# Altium schematic sheet Sheet1.SchDoc
size A3; SheetNumber: 1; SheetTotal: 1
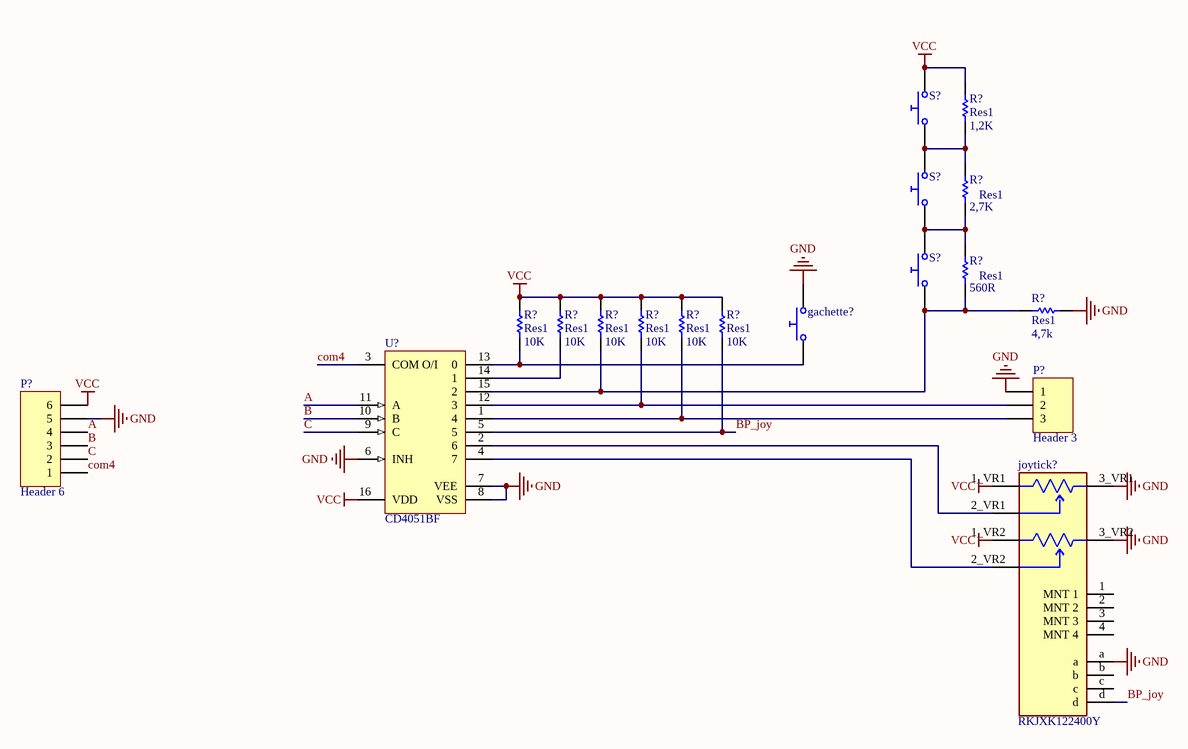
[diagram p0: Sheet1.SchDoc]

## Parts
(Parts that share a designator on the sheet are numbered #1, #2 ... from top to bottom, then left to right.)
gachette?  Push Button Normally Opened  (value not drawn)
joytick?  RKJXK122400Y  [FP-RKJXK122400Y-MFG]
P?#1  Header 3  [HDR1X3]
P?#2  Header 6  [HDR1X6]
R?#1  Res1  value 1,2K  [AXIAL-0.3]
R?#2  Res1  value 2,7K  [AXIAL-0.3]
R?#3  Res1  value 560R  [AXIAL-0.3]
R?#4  Res1  value 4,7k  [AXIAL-0.3]
R?#5  Res1  value 10K  [AXIAL-0.3]
R?#6  Res1  value 10K  [AXIAL-0.3]
R?#7  Res1  value 10K  [AXIAL-0.3]
R?#8  Res1  value 10K  [AXIAL-0.3]
R?#9  Res1  value 10K  [AXIAL-0.3]
R?#10  Res1  value 10K  [AXIAL-0.3]
S?#1  Push Button Normally Opened  (value not drawn)
S?#2  Push Button Normally Opened  (value not drawn)
S?#3  Push Button Normally Opened  (value not drawn)
U?  CD4051BF  [J0016A]

## Nets
GND: gachette?.2 joytick?.3_VR1(3_VR1) joytick?.3_VR2(3_VR2) joytick?.a P?#1.1 P?#2.5 R?#4.1 U?.6(INH) U?.7(VEE) U?.8(VSS)
VCC: joytick?.1_VR1(1_VR1) joytick?.1_VR2(1_VR2) P?#2.6 R?#1.2 R?#5.2 R?#6.2 R?#7.2 R?#8.2 R?#9.2 R?#10.2 S?#1.2 U?.16(VDD)
A: P?#2.4 U?.11(A)
B: P?#2.3 U?.10(B)
BP_joy: joytick?.d R?#10.1 U?.5
C: P?#2.2 U?.9(C)
com4: P?#2.1 U?.3(COM_O/I)
Netgachette?_1: gachette?.1 R?#5.1 U?.13(0)
Netjoytick?_2_VR1: joytick?.2_VR1(2_VR1) U?.2(6)
Netjoytick?_2_VR2: joytick?.2_VR2(2_VR2) U?.4(7)
NetP?#1_2: P?#1.2 R?#8.1 U?.12(3)
NetP?#1_3: P?#1.3 R?#9.1 U?.1(4)
NetR?#1_1: R?#1.1 R?#2.2 S?#1.1 S?#2.2
NetR?#2_1: R?#2.1 R?#3.2 S?#2.1 S?#3.2
NetR?#3_1: R?#3.1 R?#4.2 R?#7.1 S?#3.1 U?.15(2)
NetR?#6_1: R?#6.1 U?.14(1)

Not connected (* = marked no-connect by the designer): joytick? 1(MNT_1) 2(MNT_2) 3(MNT_3) 4(MNT_4) b c

## Library data of the parts
gachette? S?#1-S?#3 = Push Button NO: closed: 0; Rclosed: 1m; Ropen: 1Meg; SimulationGenericComponent: True
joytick? = CMP-24118-000005-1: Res POT 10K Ohm 0.0125W (25.4 X 20.7 X 19.3mm) Pin Bracket Mount/Through Hole Tray; Insulation Resistance: 100MR; Resistance: 10kR; Power Rating: 12.5mW; Current Rating: 50mA; Life (Hours): 100Hour; Type: Potentiometer; Mount: Through Hole; Series: RKJXV/ RKJXK; Packaging: Tray; Radiation Hardening: No; Resistor Type: Potentiometer; Termination: Pin; Height: 12.9mm; Military Standard: Not; Min Operating Temperature: -10°C; Max Operating Temperature: 70°C; Package Quantity: 1000; Contact Current Rating: 50mA; Width: 16mm; Depth: 20.7mm; Length: 16mm; RoHS Compliant: Yes
P?#1 = Header 3: Header, 3-Pin; LatestRevisionDate: 17-Jul-2002; LatestRevisionNote: Re-released for DXP Platform.; Publisher: Altium Limited
P?#2 = Header 6: Header, 6-Pin; LatestRevisionDate: 17-Jul-2002; LatestRevisionNote: Re-released for DXP Platform.; Publisher: Altium Limited
R?#1-R?#10 = Res1: Resistor; Published: 8-Jun-2000; LatestRevisionDate: 17-Jul-2002; LatestRevisionNote: Re-released for DXP Platform.; PackageReference: AXIAL-0.3; Publisher: Altium Limited; PackageDescription: Axial Device, Thru-Hole; 2 Leads; 0.3 in Pin Spacing
U? = CMP-1575-00057-4: CMOS Single 8-Channel Analog Multiplexer/Demultiplexer with Logic-Level Conversion, J0016A, TUBE; Generic Part Number: CD4051B-MIL; Manufacturer: Texas Instruments; VCC(Max)(V): 18; VCC(Min)(V): 5; Crosstalk: Yes; ICC(Typ)(mA): 0.00008; Bandwidth(Max)(MHz): 20; Ron(Typ)(Ohms): 125; Rating: Military; Ron(Max)(Ohms): 240; Configuration: 1 X 1：8 MUX; PackageReference: J0016A; PackageVersion: http://www.ti.com/lit/ml/mcer002d/mcer002d.pdf; Operating Temperature Range(C): -55 to 125; DatasheetVersion: SCHS047G